# Altium project ITL230216.PrjPcb
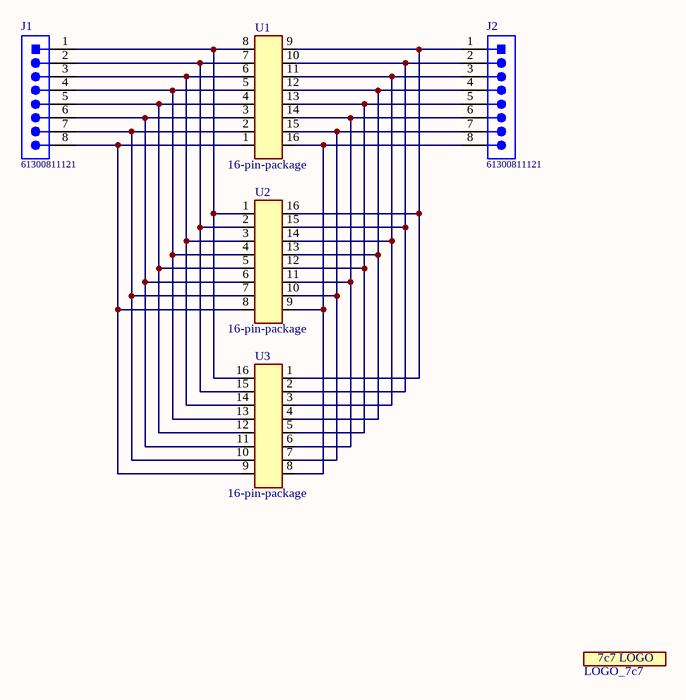
[diagram p0: ITL230216.SchDoc]
project_revision: E1.01; board_name: ITL230216
1 sheet, 6 parts. Net scope: global (net labels, ports and power ports of the same name join across sheets).
Board file: ITL230216.PcbDoc

## Sheet ITL230216.SchDoc: SMD 16-pin breakout
size A4; Engineer: CT; SheetNumber: 1; SheetTotal: 1

### Parts
GR1  LOGO_7c7  [LOGO_7c7_silk_3MM]  (no BOM)
J1  61300811121  [61300811121]
J2  61300811121  [61300811121]
U1  16-pin-package  [TSSOP16-0.65-4.4-L]
U2  16-pin-package  [SOP16-N]
U3  16-pin-package  [MSOP16]

### Nets
NetJ1_1: J1.1 U1.8 U2.1 U3.16
NetJ1_2: J1.2 U1.7 U2.2 U3.15
NetJ1_3: J1.3 U1.6 U2.3 U3.14
NetJ1_4: J1.4 U1.5 U2.4 U3.13
NetJ1_5: J1.5 U1.4 U2.5 U3.12
NetJ1_6: J1.6 U1.3 U2.6 U3.11
NetJ1_7: J1.7 U1.2 U2.7 U3.10
NetJ1_8: J1.8 U1.1 U2.8 U3.9
NetJ2_1: J2.1 U1.9 U2.16 U3.1
NetJ2_2: J2.2 U1.10 U2.15 U3.2
NetJ2_3: J2.3 U1.11 U2.14 U3.3
NetJ2_4: J2.4 U1.12 U2.13 U3.4
NetJ2_5: J2.5 U1.13 U2.12 U3.5
NetJ2_6: J2.6 U1.14 U2.11 U3.6
NetJ2_7: J2.7 U1.15 U2.10 U3.7
NetJ2_8: J2.8 U1.16 U2.9 U3.8

### Notes on the sheet
- Title
- 7c7 Engineering
- Size:
- Project:
- Engineer:
- A4
- Date:
- Revision:
- Sheet
- of
- Doorniksewijk 133-A
- 8500 Kortrijk
- Belgium
- File:
- 7c7engineering.com <http://7c7engineering.com>
- (in symbol CMP-001-0005-7) 7c7 LOGO

### Library data of the parts
GR1 = CMP-001-0005-7: The 7c7 logo: Be proud of our designs and stamp that logo on there!
J1 J2 = CMP-045-000168-2: WR-PHD Pin Header, THT, pitch 2.54mm, Single Row, Vertical, 8p; Manufacturer: Wurth Elektronik; Pin Number: 8; Contact Resistance: 20mOhm; Rated Current: 3A; Withstanding Voltage: 500VAC; Working Voltage: 250VAC; Packaging: Bag; Design Item ID: 61300811121; ComponentLink1Description: Manufacturer; Manufacturer Part Number: 61300811121; Orientation: Vertical; Gender: Pin Header; Source: WR-PHD_Pin Header.SchLib; Row Number: Single; Mounting Technology: THT; Pitch: 2.54mm; ComponentLink1URL: http://www.we-online.de; Pin Count: 8; ComponentLink2URL: https://www.we-online.com/catalog/datasheet/61300811121.pdf; Component Type: Standard; ComponentLink2Description: Datasheet; Operating Temperature: -40 to +105degC
U1-U3 = CMP-002-001058-6: package adapter

## Assembly variants
A: not fitted J1 J2 U1 U2 U3